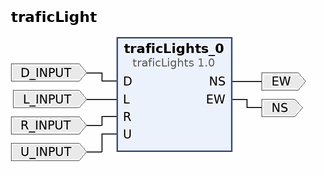
[diagram p0: block diagram of the top level]
# Vivado block design traficLight, xc7z020clg400-1, Vivado 2022.2
create_bd_design traficLight

create_bd_port -dir I -type data R_INPUT
create_bd_port -dir I -type data L_INPUT
create_bd_port -dir I -type data U_INPUT
create_bd_port -dir I -type data D_INPUT
create_bd_port -dir O -type data EW
create_bd_port -dir O -type data NS

create_bd_cell -type ip -vlnv xilinx.com:hls:traficLights:1.0 traficLights_0

# ---- connections ----

connect_bd_net -net D_0_1 [get_bd_ports D_INPUT] [get_bd_pins traficLights_0/D]
connect_bd_net -net L_0_1 [get_bd_ports L_INPUT] [get_bd_pins traficLights_0/L]
connect_bd_net -net R_0_1 [get_bd_ports R_INPUT] [get_bd_pins traficLights_0/R]
connect_bd_net -net U_0_1 [get_bd_ports U_INPUT] [get_bd_pins traficLights_0/U]
connect_bd_net [get_bd_pins traficLights_0/EW] [get_bd_ports NS]
connect_bd_net [get_bd_pins traficLights_0/NS] [get_bd_ports EW]

validate_bd_design
save_bd_design
